# Altium schematic sheet Sch_Dr_General.SchDoc
size A3; Organization: Altium Limited; Address1: L3, 12a Rodborough Rd; Address2: Frenchs Forest; Address3: NSW; Address4: Australia 2086
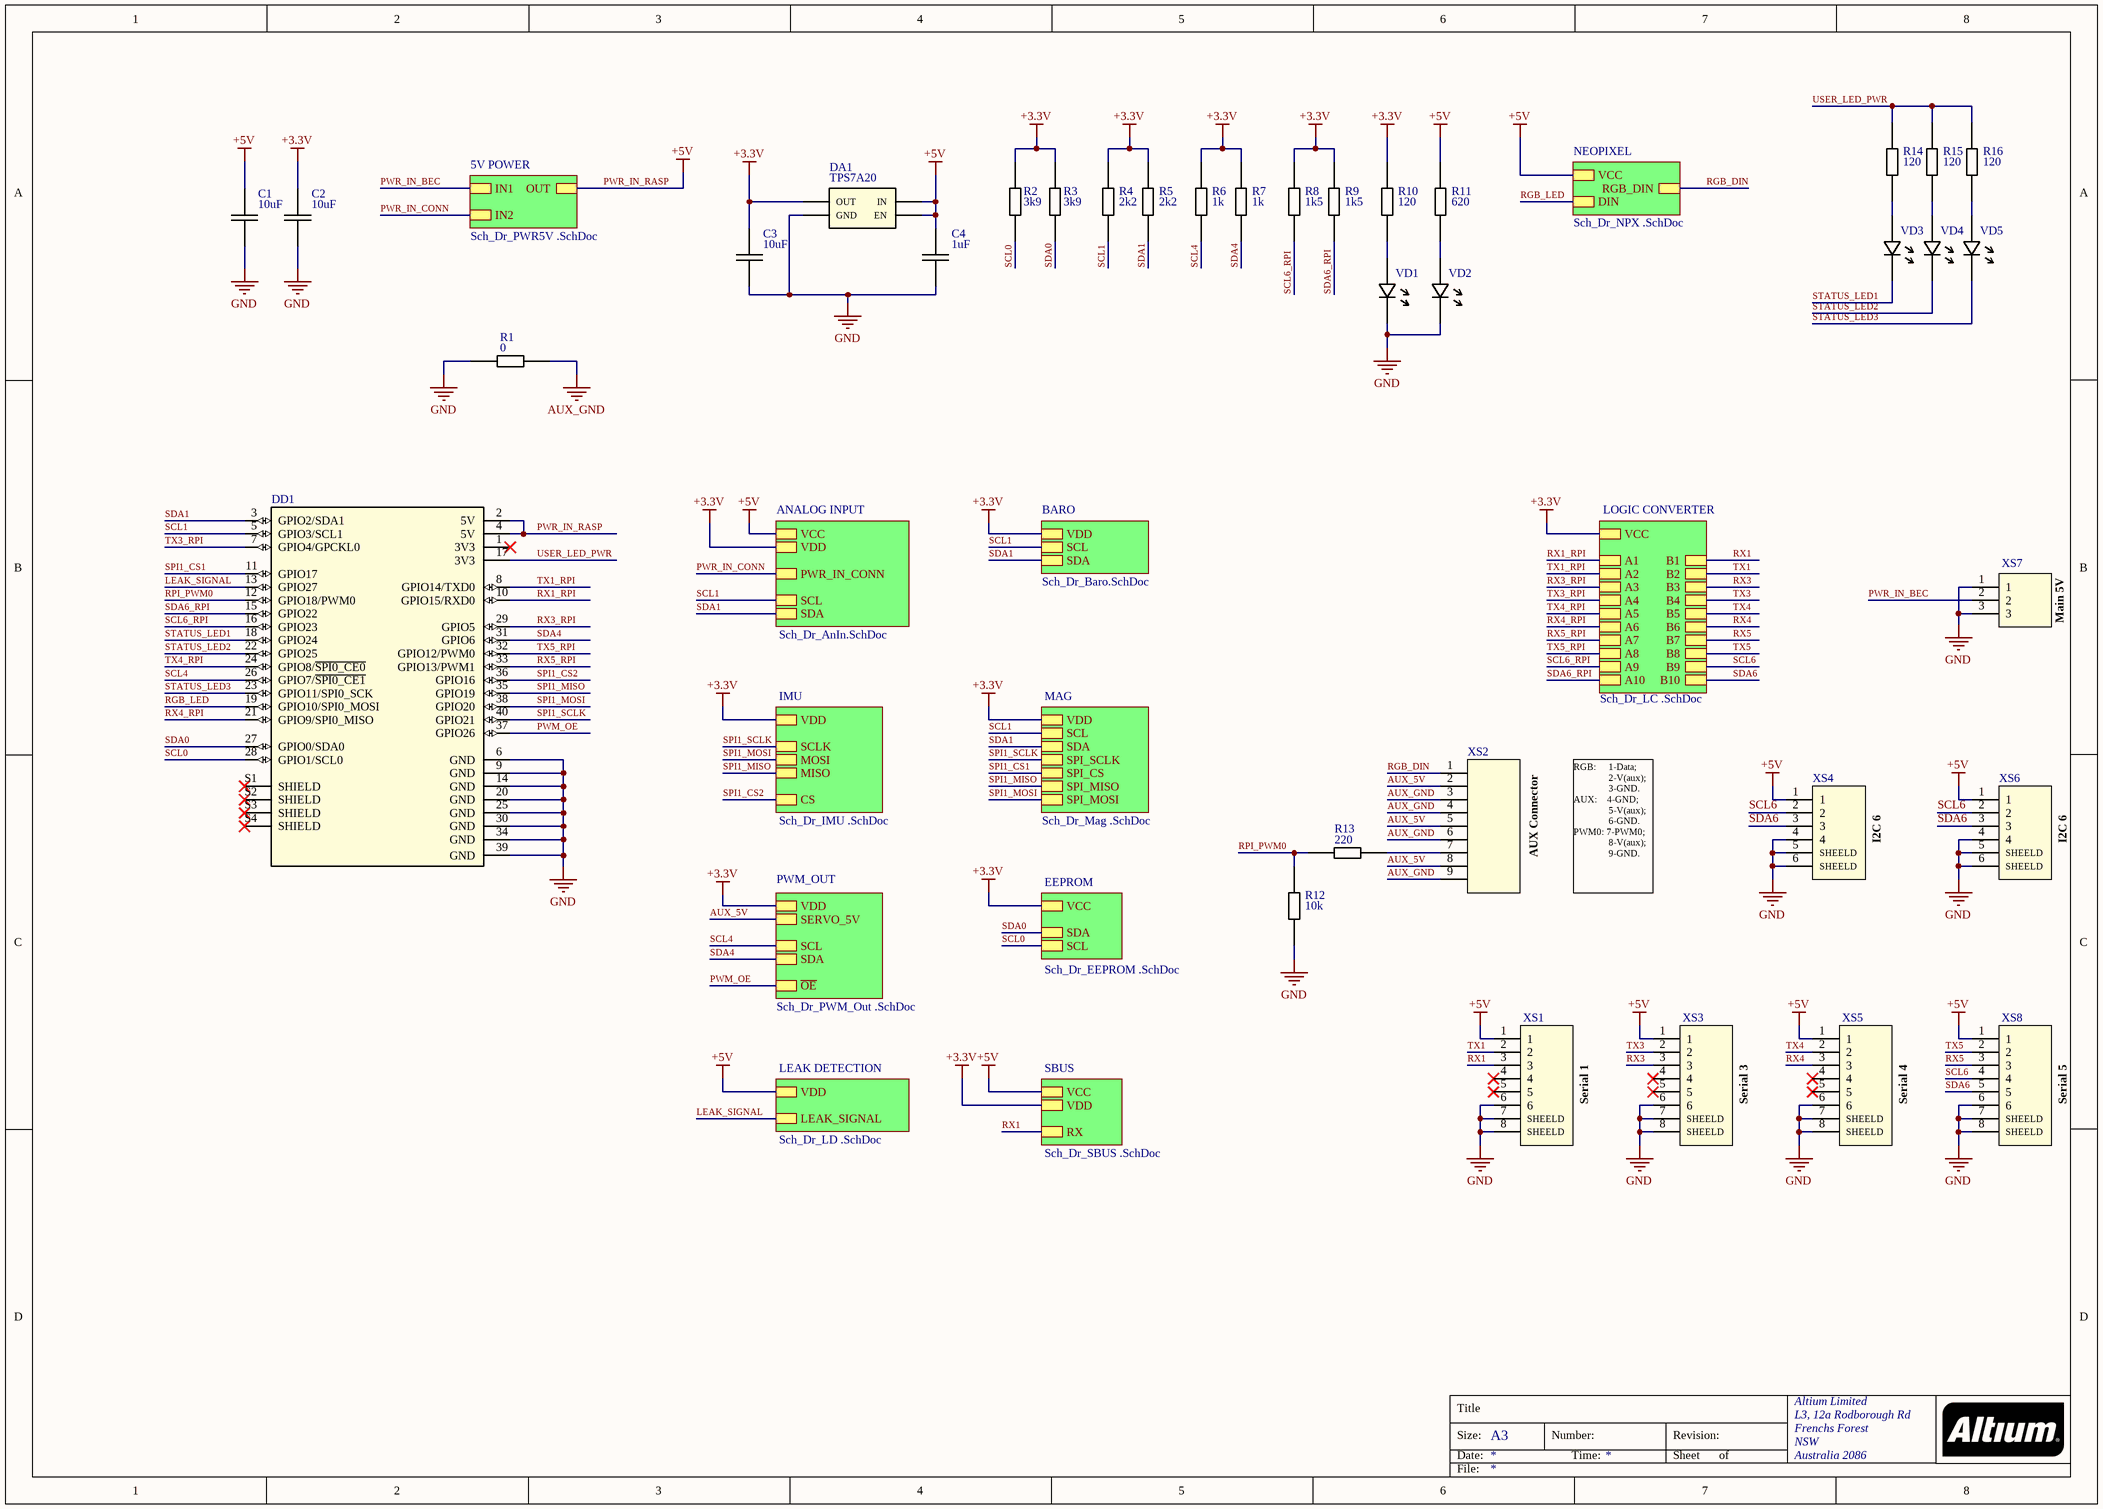
[diagram p0: Sch_Dr_General.SchDoc]

## Parts
C1  10uF  [Cap_0603]
C2  10uF  [Cap_0603]
C3  10uF  [Cap_0603]
C4  1uF  [Cap_0603]
DA1  TPS7A20  [SOT-23-5]
DD1  RASPBERRY_PI_4  [MOD_RASPBERRY_PI_4B_4GB]  (value not drawn)
R1  0  [Res_0603]
R2  3k9  [Res_0603]
R3  3k9  [Res_0603]
R4  2k2  [Res_0603]
R5  2k2  [Res_0603]
R6  1k  [Res_0603]
R7  1k  [Res_0603]
R8  1k5  [Res_0603]
R9  1k5  [Res_0603]
R10  120  [Res_0603]
R11  620  [Res_0603]
R12  10k  [Res_0603]
R13  220  [Res_0603]
R14  120  [Res_0603]
R15  120  [Res_0603]
R16  120  [Res_0603]
VD1  TO-1608BC-PG  [0603_LED]  (value not drawn)
VD2  TO-1608BC-PG  [0603_LED]  (value not drawn)
VD3  TO-1608BC-PG  [0603_LED]  (value not drawn)
VD4  TO-1608BC-PG  [0603_LED]  (value not drawn)
VD5  TO-1608BC-PG  [0603_LED]  (value not drawn)
XS1  BM06B-GHS-TBT(LF)(SN)(N)  [BM06B-GHS-TBT]  (value not drawn)
XS2  PLS-9  [AUX_CON]  (value not drawn)
XS3  BM06B-GHS-TBT(LF)(SN)(N)  [BM06B-GHS-TBT]  (value not drawn)
XS4  BM04B-GHS-TBT(LF)(SN)(N)  [BM04B-GHS-TBT]  (value not drawn)
XS5  BM06B-GHS-TBT(LF)(SN)(N)  [BM06B-GHS-TBT]  (value not drawn)
XS6  BM04B-GHS-TBT(LF)(SN)(N)  [BM04B-GHS-TBT]  (value not drawn)
XS7  PLS-3  [3X]  (value not drawn)
XS8  BM06B-GHS-TBT(LF)(SN)(N)  [BM06B-GHS-TBT]  (value not drawn)

## Sub-sheets
5V POWER = Sch_Dr_PWR5V .SchDoc: OUT, IN2, IN1
ANALOG INPUT = Sch_Dr_AnIn.SchDoc: VCC, VDD, PWR_IN_CONN, SCL, SDA
BARO = Sch_Dr_Baro.SchDoc: VDD, SCL, SDA
EEPROM = Sch_Dr_EEPROM .SchDoc: VCC, SDA, SCL
IMU = Sch_Dr_IMU .SchDoc: VDD, SCLK, MOSI, MISO, CS
LEAK DETECTION = Sch_Dr_LD .SchDoc: VDD, LEAK_SIGNAL
LOGIC CONVERTER = Sch_Dr_LC .SchDoc: A1, A2, A3, A4, A5, A6, A7, A8, A9, A10, B1, B2, B3, B4, B5, B6, B7, B8, B9, B10, VCC
MAG = Sch_Dr_Mag .SchDoc: VDD, SCL, SDA, SPI_SCLK, SPI_CS, SPI_MISO, SPI_MOSI
NEOPIXEL = Sch_Dr_NPX .SchDoc: VCC, DIN, RGB_DIN
PWM_OUT = Sch_Dr_PWM_Out .SchDoc: SERVO_5V, SCL, SDA, ~{OE}, VDD
SBUS = Sch_Dr_SBUS .SchDoc: VCC, VDD, RX

## Nets
+3.3V: C2.2 C3.2 DA1.5(OUT) R2.2 R3.2 R4.1 R5.1 R6.1 R7.1 R8.1 R9.1 R10.1 ; sheet BARO/VDD, sheet ANALOG INPUT/VDD, sheet IMU/VDD, sheet MAG/VDD, sheet PWM_OUT/VDD, sheet EEPROM/VCC, sheet SBUS/VDD, sheet LOGIC CONVERTER/VCC
AUX_GND: R1.2 XS2.3 XS2.4 XS2.6 XS2.9
GND: C1.1 C2.1 C3.1 C4.1 DA1.2(GND) DD1.6(GND) DD1.9(GND) DD1.14(GND) DD1.20(GND) DD1.25(GND) DD1.30(GND) DD1.34(GND) DD1.39(GND) R1.1 R12.2 VD1.1(K) VD2.1(K) XS1.6 XS1.7(SHEELD) XS1.8(SHEELD) XS3.6 XS3.7(SHEELD) XS3.8(SHEELD) XS4.4 XS4.5(SHEELD) XS4.6(SHEELD) XS5.6 XS5.7(SHEELD) XS5.8(SHEELD) XS6.4 XS6.5(SHEELD) XS6.6(SHEELD) XS7.1 XS7.3 XS8.6 XS8.7(SHEELD) XS8.8(SHEELD)
PWR_IN_RASP: C1.2 C4.2 DA1.1(IN) DA1.3(EN) DD1.2(5V) DD1.4(5V) R11.1 XS1.1 XS3.1 XS4.1 XS5.1 XS6.1 XS8.1 ; sheet 5V POWER/OUT, sheet NEOPIXEL/VCC, sheet ANALOG INPUT/VCC, sheet LEAK DETECTION/VDD, sheet SBUS/VCC  [also labelled +5V]
AUX_5V: XS2.2 XS2.5 XS2.8 ; sheet PWM_OUT/SERVO_5V
LEAK_SIGNAL: DD1.13(GPIO27) ; sheet LEAK DETECTION/LEAK_SIGNAL
PWM_OE: DD1.37(GPIO26) ; sheet PWM_OUT/~{OE}
PWR_IN_BEC: XS7.2 ; sheet 5V POWER/IN1
PWR_IN_CONN: sheet 5V POWER/IN2, sheet ANALOG INPUT/PWR_IN_CONN
RGB_DIN: XS2.1 ; sheet NEOPIXEL/RGB_DIN
RGB_LED: DD1.19(GPIO10/SPI0_MOSI) ; sheet NEOPIXEL/DIN
RPI_PWM0: DD1.12(GPIO18/PWM0) R12.1 R13.1
RX1: XS1.3 ; sheet SBUS/RX, sheet LOGIC CONVERTER/B1
RX1_RPI: DD1.10(GPIO15/RXD0) ; sheet LOGIC CONVERTER/A1
RX3: XS3.3 ; sheet LOGIC CONVERTER/B3
RX3_RPI: DD1.29(GPIO5) ; sheet LOGIC CONVERTER/A3
RX4: XS5.3 ; sheet LOGIC CONVERTER/B6
RX4_RPI: DD1.21(GPIO9/SPI0_MISO) ; sheet LOGIC CONVERTER/A6
RX5: XS8.3 ; sheet LOGIC CONVERTER/B7
RX5_RPI: DD1.33(GPIO13/PWM1) ; sheet LOGIC CONVERTER/A7
SCL0: DD1.28(GPIO1/SCL0) R2.1 ; sheet EEPROM/SCL
SCL1: DD1.5(GPIO3/SCL1) R4.2 ; sheet BARO/SCL, sheet ANALOG INPUT/SCL, sheet MAG/SCL
SCL4: DD1.26(GPIO7/~{SPI0_CE1}) R6.2 ; sheet PWM_OUT/SCL
SCL6: XS4.2 XS6.2 XS8.4 ; sheet LOGIC CONVERTER/B9
SCL6_RPI: DD1.16(GPIO23) R8.2 ; sheet LOGIC CONVERTER/A9
SDA0: DD1.27(GPIO0/SDA0) R3.1 ; sheet EEPROM/SDA
SDA1: DD1.3(GPIO2/SDA1) R5.2 ; sheet BARO/SDA, sheet ANALOG INPUT/SDA, sheet MAG/SDA
SDA4: DD1.31(GPIO6) R7.2 ; sheet PWM_OUT/SDA
SDA6: XS4.3 XS6.3 XS8.5 ; sheet LOGIC CONVERTER/B10
SDA6_RPI: DD1.15(GPIO22) R9.2 ; sheet LOGIC CONVERTER/A10
SPI1_CS1: DD1.11(GPIO17) ; sheet MAG/SPI_CS
SPI1_CS2: DD1.36(GPIO16) ; sheet IMU/CS
SPI1_MISO: DD1.35(GPIO19) ; sheet IMU/MISO, sheet MAG/SPI_MISO
SPI1_MOSI: DD1.38(GPIO20) ; sheet IMU/MOSI, sheet MAG/SPI_MOSI
SPI1_SCLK: DD1.40(GPIO21) ; sheet IMU/SCLK, sheet MAG/SPI_SCLK
STATUS_LED1: DD1.18(GPIO24) VD3.1(K)
STATUS_LED2: DD1.22(GPIO25) VD4.1(K)
STATUS_LED3: DD1.23(GPIO11/SPI0_SCK) VD5.1(K)
TX1: XS1.2 ; sheet LOGIC CONVERTER/B2
TX1_RPI: DD1.8(GPIO14/TXD0) ; sheet LOGIC CONVERTER/A2
TX3: XS3.2 ; sheet LOGIC CONVERTER/B4
TX3_RPI: DD1.7(GPIO4/GPCKL0) ; sheet LOGIC CONVERTER/A4
TX4: XS5.2 ; sheet LOGIC CONVERTER/B5
TX4_RPI: DD1.24(GPIO8/~{SPI0_CE0}) ; sheet LOGIC CONVERTER/A5
TX5: XS8.2 ; sheet LOGIC CONVERTER/B8
TX5_RPI: DD1.32(GPIO12/PWM0) ; sheet LOGIC CONVERTER/A8
USER_LED_PWR: DD1.17(3V3) R14.1 R15.1 R16.1
NetR10_2: R10.2 VD1.2(A)
NetR11_2: R11.2 VD2.2(A)
NetR13_2: R13.2 XS2.7
NetR14_2: R14.2 VD3.2(A)
NetR15_2: R15.2 VD4.2(A)
NetR16_2: R16.2 VD5.2(A)

Not connected (* = marked no-connect by the designer): DD1 1(3V3)* S1(SHIELD)* S2(SHIELD)* S3(SHIELD)* S4(SHIELD)*; XS1 4* 5*; XS3 4* 5*; XS5 4* 5*

## Notes on the sheet
- Main 5V
- AUX Connector
- I2C 6
- RGB:     1-Data;
  2-V(aux);
  3-GND.
  AUX:    4-GND;
  5-V(aux);
  6-GND.
  PWM0: 7-PWM0;
  8-V(aux);
  9-GND.
- Serial 1
- Serial 3
- Serial 4
- Serial 5
- Title
- Size:
- Date:
- A3
- Number:
- Time:
- Revision:
- Sheet
- of
- File:

## Library data of the parts
C1-C3 = Cap_: CC0603KRX5R7BB106
C4 = Cap_: CC0603JRX7R7BB105
DA1 = TPS7A20: High PSRR LDO
DD1 = RASPBERRY_PI_4B_4GB: BCM2711 Raspberry Pi 4 Model B 4GB - ARMÂ® CortexÂ®-A72 MPU Embedded Evaluation Board; MP: RASPBERRY PI 4B/4GB; Price: None; MF: Raspberry Pi; Check_prices: https://www.snapeda.com/parts/RASPBERRY%20PI%204B/4GB/Raspberry+Pi/view-part/?ref=eda; Value: *; Purchase-URL: https://pricing.snapeda.com/search/part/RASPBERRY PI 4B/4GB/?ref=eda; Availability: In Stock; SnapEDA_Link: https://www.snapeda.com/parts/RASPBERRY%20PI%204B/4GB/Raspberry+Pi/view-part/?ref=snap; Package: None
R1 = Res_: CR-03FL7----0R
R2 R3 = Res_: CR-03FL7---3K9
R4 R5 = Res_: CR-03FL7---2K2
R6 R7 = Res_: CR-03FL7----1K
R8 R9 = Res_: CR-03FL7---1K5
R10 R14 R16 = Res_: CR-03FL7--120R
R11 = Res_: CR-03FL7--620R
R12 = Res_: CR-03FL7---10K
R13 = Res_: CR-03FL7--220R
R15 = Res_: CR-03FL7---120R
VD1-VD5 = LED_: SMD LED Green
XS2 = AUX_CON